# EAGLE schematic Passive Filter PCB Design Large Board (EAGLE 9.6.2)
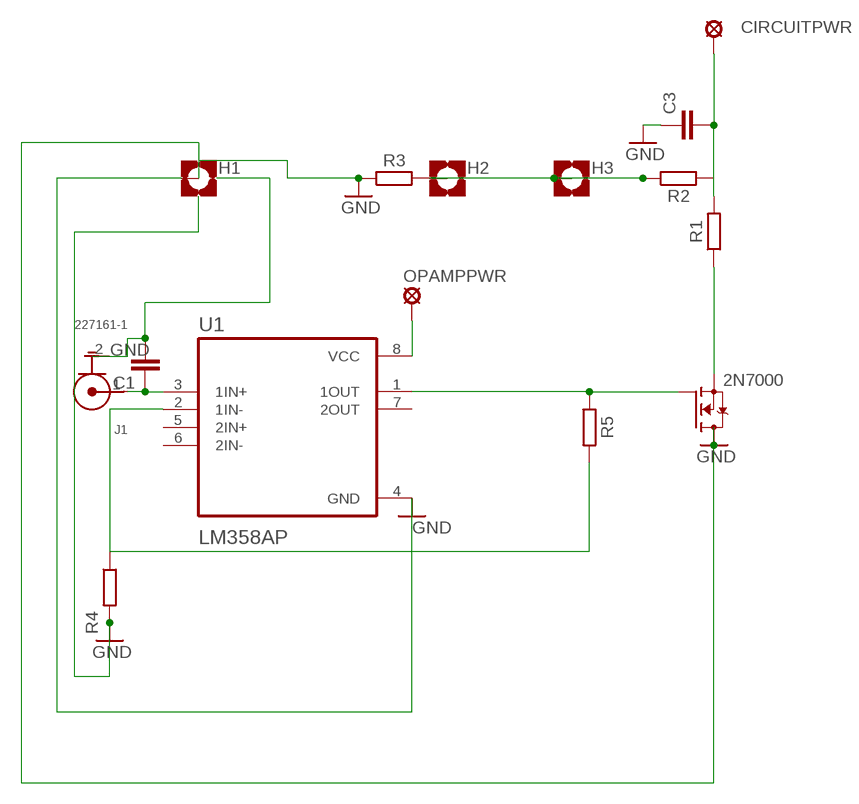
[diagram p0: schematic, sheet 1]

## Parts
C1  C5/3.5  [C5B3.5]
C3  C5/3.5  [C5B3.5]
CIRCUITPWR  MCS10B  [MCS10B]
H1  MOUNT-PAD-SQUARE2.8  [2,8-PAD-SQUARE]
H2  MOUNT-PAD-SQUARE2.8  [2,8-PAD-SQUARE]
H3  MOUNT-PAD-SQUARE2.8  [2,8-PAD-SQUARE]
J1  227161-1  [TE_227161-1]
OPAMPPWR  LSP10  [LSP10]
R1  R_AXIAL-7.2MM-PITCH  [RESAD724W46L381D178B]
R2  R_AXIAL-7.2MM-PITCH  [RESAD724W46L381D178B]
R3  R_AXIAL-7.2MM-PITCH  [RESAD724W46L381D178B]
R4  R_AXIAL-7.2MM-PITCH  [RESAD724W46L381D178B]
R5  R_AXIAL-7.2MM-PITCH  [RESAD724W46L381D178B]
SHUNT  2N7000  [TO92-]
U1  LM358AP  [DIP794W45P254L959H508Q8]

## Nets
GND: C1.2 C3.1 H1.B2,8(MOUNT) J1.2(G) R3.1 R4.2 SHUNT.1(D) U1.4(GND)
MOKU-IN: C1.1 J1.1(C) U1.3(1IN+)
N$1: R1.1 SHUNT.3(S)
N$3: H2.B2,8(MOUNT) H3.B2,8(MOUNT) R2.1 R3.2
N$4: OPAMPPWR.MP U1.8(VCC)
N$5: R5.1 SHUNT.2(G) U1.1(1OUT)
N$7: R4.1 R5.2 U1.2(1IN-)
V+30V: C3.2 CIRCUITPWR.MP R1.2 R2.2
Unconnected: U1.5(2IN+) U1.6(2IN-) U1.7(2OUT)

## Library data of the parts
C1 C3 = capacitor-wima:C: CAPACITOR naming: grid - package width
CIRCUITPWR = solpad:MCS10B: SOLDER PAD MC S1, distributor Buerklin, 15F505
H1-H3 = holes:MOUNT-PAD-SQUARE: MOUNTING PAD, square
J1 = 227161-1:227161-1: CONN BNC JACK R/A 50 OHM PCB Check availability <https://pricing.snapeda.com/parts/227161-1/TE%20Connectivity/view-part?ref=eda>; AVAILABILITY: In Stock; COMMENT: 227161-1; DESCRIPTION: BNC Series 50 Ohm Right Angle Through Hole Jack Female Socket Connector; MF: TE Connectivity; MP: 227161-1; PACKAGE: None; PRICE: None; PURCHASE-URL: https://pricing.snapeda.com/search/part/227161-1/?ref=eda
OPAMPPWR = solpad:LSP10: SOLDER PAD drill 1.0 mm, distributor Buerklin, 12H555
R1-R5 = Resistor:R: Resistor Fixed - Generic; CATEGORY: Resistor; SUB-CATEGORY: Fixed
SHUNT = 2N7000:2N7000: Check availability <https://pricing.snapeda.com/parts/2N7000/STMicroelectronics/view-part?ref=eda>; AVAILABILITY: In Stock; DESCRIPTION: N-Channel 60 V 350mA (Tc) 1W (Tc) Through Hole TO-92-3; MF: STMicroelectronics; MP: 2N7000; PACKAGE: E-PKG AXIAL-LEADED-2 ON Semiconductor; PRICE: None; PURCHASE-URL: https://pricing.snapeda.com/search/part/2N7000/?ref=eda
U1 = LM358AP:LM358AP: Check availability <https://pricing.snapeda.com/parts/LM358AP/Texas%20Instruments/view-part?ref=eda>; AVAILABILITY: In Stock; DESCRIPTION: Dual, 30-V, 700-kHz, 3-mV offset voltage operational amplifier; MF: Texas Instruments; MP: LM358AP; PACKAGE: PDIP-8 Texas; PRICE: None; PURCHASE-URL: https://pricing.snapeda.com/search/part/LM358AP/?ref=eda

## Net classes
0 default: width 0.305 mm, drill 0.813 mm, clearance 0.254 mm